# Altium schematic sheet connectors.SchDoc
size A4
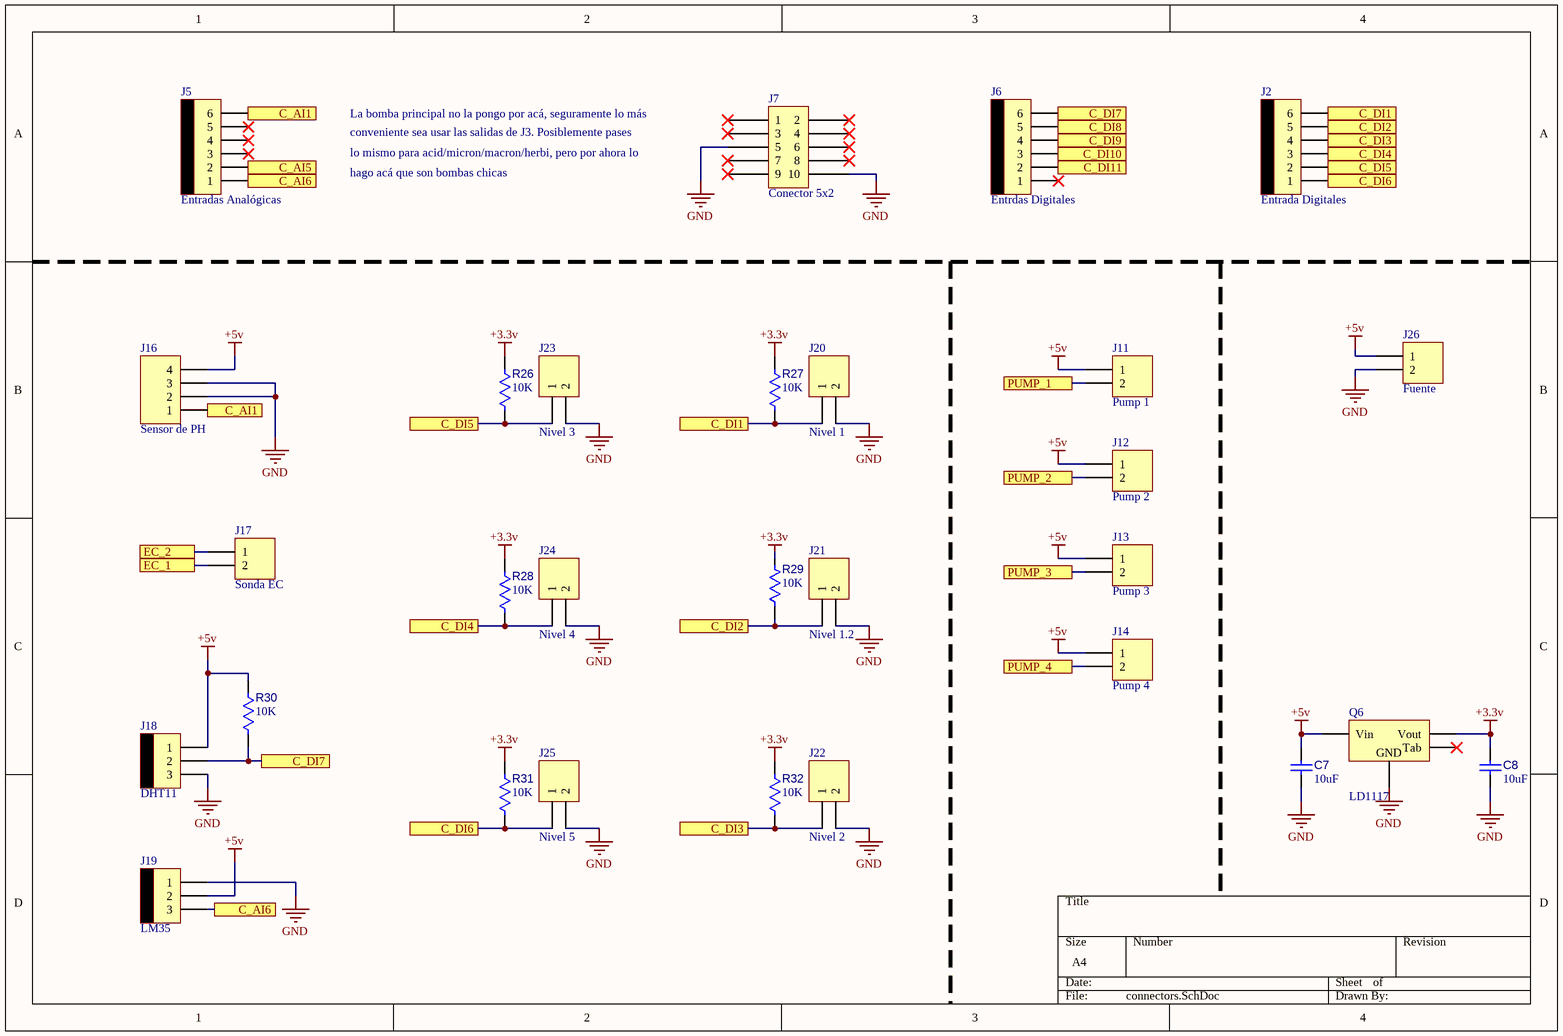
[diagram p0: connectors.SchDoc]

## Parts
C7  10uF  [CAPC3216x130N]
C8  10uF  [CAPC3216x130N]
J2  Entrada Digitales  [MOLEX6]
J5  Entradas Analógicas  [MOLEX6]
J6  Entrdas Digitales  [MOLEX6]
J7  Conector 5x2  [CONN_5x2_BOX]
J11  Pump 1  [MOLEX2]
J12  Pump 2  [MOLEX2]
J13  Pump 3  [MOLEX2]
J14  Pump 4  [MOLEX2]
J16  Sensor de PH  [HDR1X4]
J17  Sonda EC  [HDR1X2H]
J18  DHT11  [MOLEX3]
J19  LM35  [MOLEX3]
J20  Nivel 1  [MOLEX2]
J21  Nivel 1.2  [MOLEX2]
J22  Nivel 2  [MOLEX2]
J23  Nivel 3  [MOLEX2]
J24  Nivel 4  [MOLEX2]
J25  Nivel 5  [MOLEX2]
J26  Fuente  [CON_2_156]
Q6  LD1117  [SOT223_N]
R26  10K  [0805]
R27  10K  [0805]
R28  10K  [0805]
R29  10K  [0805]
R30  10K  [0805]
R31  10K  [0805]
R32  10K  [0805]

## Ports
C_AI1, C_AI5, C_AI6, C_DI1, C_DI2, C_DI3, C_DI4, C_DI5, C_DI6, C_DI7, C_DI8, C_DI9, C_DI10, C_DI11, EC_1, EC_2, PUMP_1, PUMP_2, PUMP_3, PUMP_4

## Nets
+3.3v: C8.2 Q6.2(Vout) R26.2 R27.2 R28.2 R29.2 R31.2 R32.2
+5v: C7.1 J11.1 J12.1 J13.1 J14.1 J16.4 J18.1 J19.2 J26.1 Q6.3(Vin) R30.2
GND: C7.2 C8.1 J7.5 J7.10 J16.2 J16.3 J18.3 J19.1 J20.2 J21.2 J22.2 J23.2 J24.2 J25.2 J26.2 Q6.1(GND)
C_AI1: J5.6 J16.1 ; port C_AI1
C_AI5: J5.2 ; port C_AI5
C_AI6: J5.1 J19.3 ; port C_AI6
C_DI1: J2.6 J20.1 R27.1 ; port C_DI1
C_DI2: J2.5 J21.1 R29.1 ; port C_DI2
C_DI3: J2.4 J22.1 R32.1 ; port C_DI3
C_DI4: J2.3 J24.1 R28.1 ; port C_DI4
C_DI5: J2.2 J23.1 R26.1 ; port C_DI5
C_DI6: J2.1 J25.1 R31.1 ; port C_DI6
C_DI7: J6.6 J18.2 R30.1 ; port C_DI7
C_DI8: J6.5 ; port C_DI8
C_DI9: J6.4 ; port C_DI9
C_DI10: J6.3 ; port C_DI10
C_DI11: J6.2 ; port C_DI11
EC_1: J17.2 ; port EC_1
EC_2: J17.1 ; port EC_2
PUMP_1: J11.2 ; port PUMP_1
PUMP_2: J12.2 ; port PUMP_2
PUMP_3: J13.2 ; port PUMP_3
PUMP_4: J14.2 ; port PUMP_4

Not connected (* = marked no-connect by the designer): J5 3* 4* 5*; J6 1*; J7 1* 2* 3* 4* 6* 7* 8* 9*; Q6 4(Tab)*

## Notes on the sheet
- La bomba principal no la pongo por acá, seguramente lo más
- conveniente sea usar las salidas de J3. Posiblemente pases
- lo mismo para acid/micron/macron/herbi, pero por ahora lo
- hago acá que son bombas chicas

## Library data of the parts
C7 C8 = Cap: Tolerance: ±10%; Voltage-Rated: 6.3V; Package: 0603; Value: 10uF
J2 J5 J6 = MOLEX6
J11-J14 J20-J26 = Header 2: Header, 2-Pin; LatestRevisionDate: 17-Jul-2002; LatestRevisionNote: Re-released for DXP Platform.; Publisher: Altium Limited
J16 = Header 4: LatestRevisionDate: 17-Jul-2002; LatestRevisionNote: Re-released for DXP Platform.; Publisher: Altium Limited
J17 = Header 2H: Header, 2-Pin, Right Angle; LatestRevisionDate: 17-Jul-2002; LatestRevisionNote: Re-released for DXP Platform.; Publisher: Altium Limited
J18 J19 = MOLEX3
Q6 = LD1117: Voltage Reg., Low Drop; PackageReference: SOT-223; PackageDescription: 3-Pin Transistor Outline Package 2.54 mm Pitch, 15.1 mm Lead Span
R26-R32 = Res: Resistor; Tolerance: 1%; Package: 0603; Value: 10K